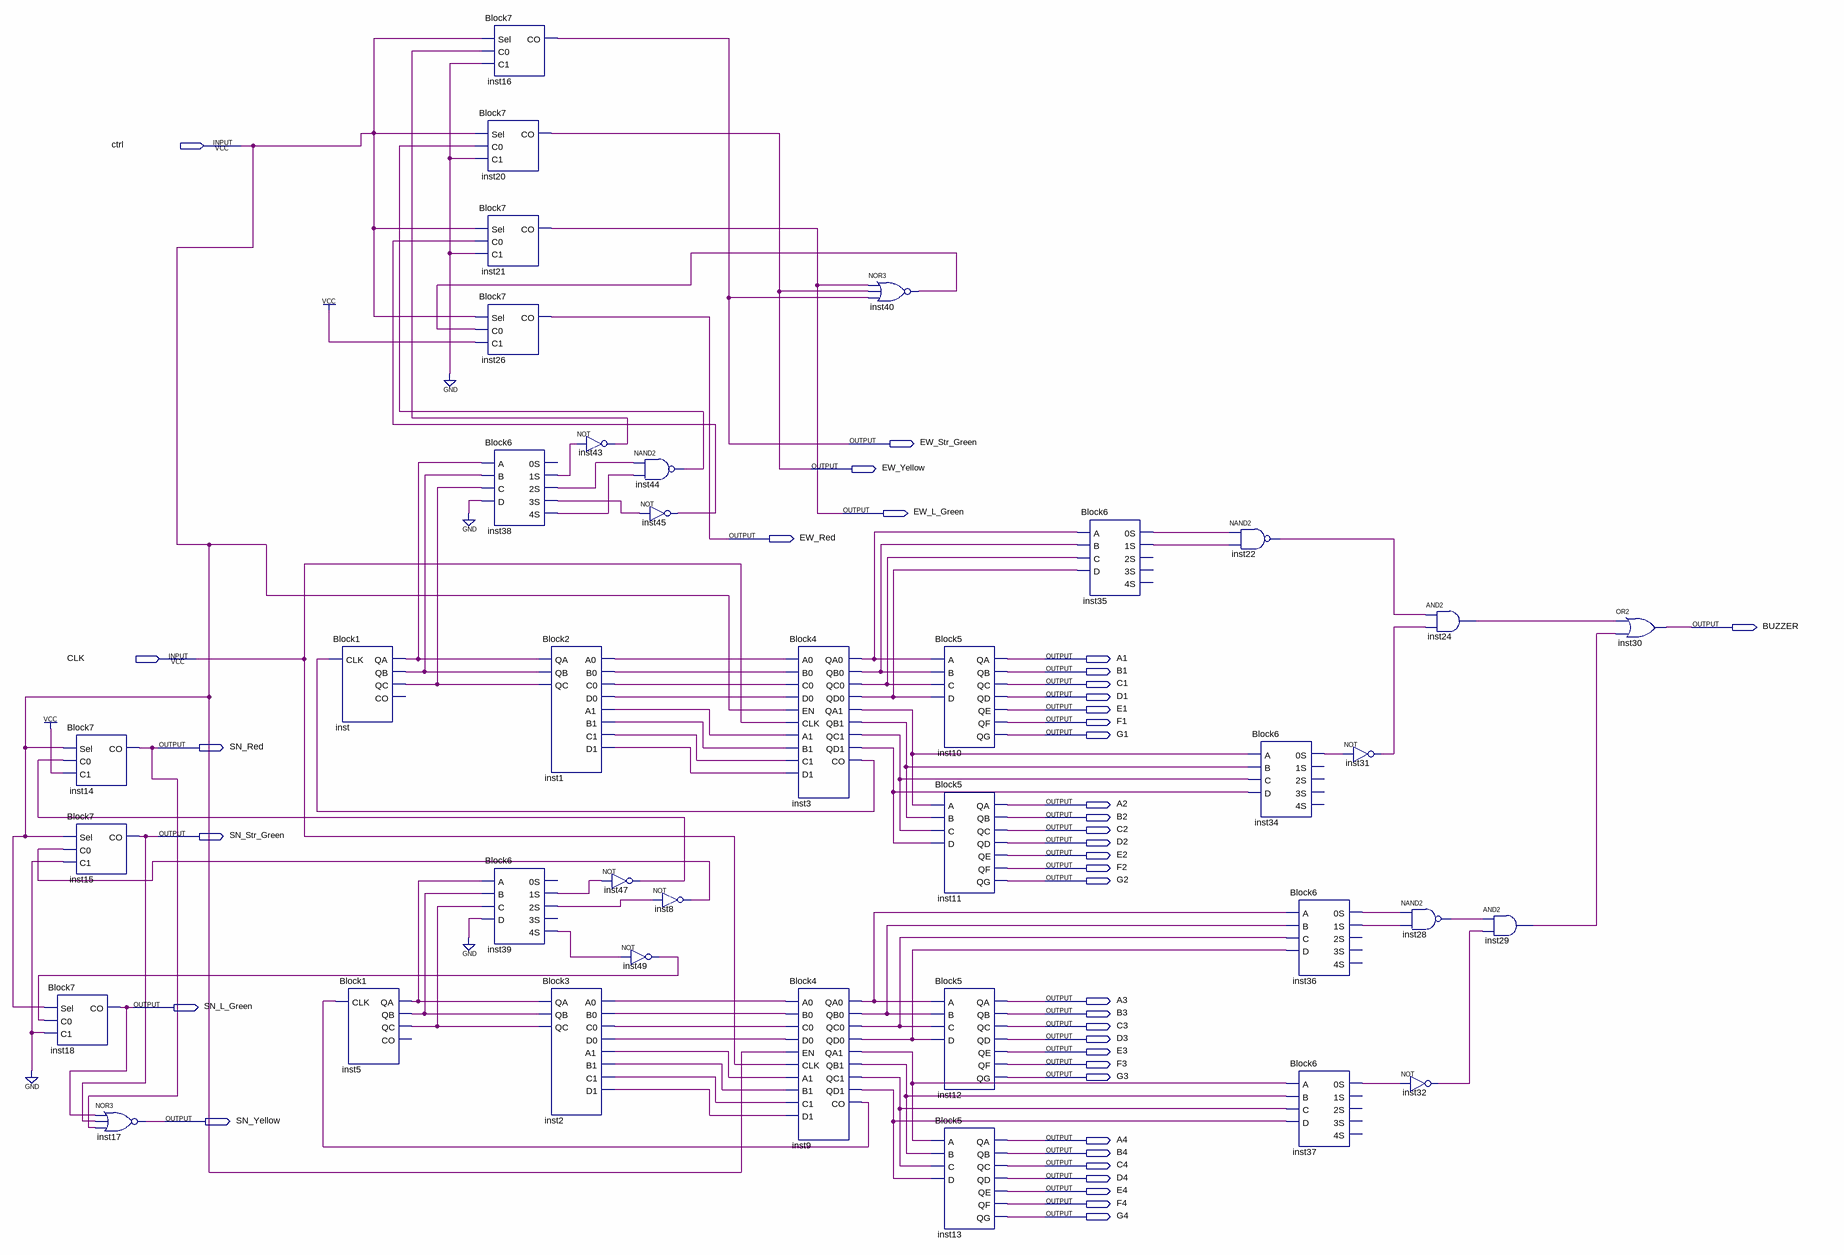
[diagram p0: schematic sheet]
// Quartus schematic TEST.bdf as structural Verilog: 38 symbols, 39 pins
module TEST (
  input  ctrl,
  input  CLK,
  output EW_Str_Green,
  output EW_Yellow,
  output EW_L_Green,
  output EW_Red,
  output BUZZER,
  output A1,
  output B1,
  output C1,
  output D1,
  output E1,
  output F1,
  output G1,
  output SN_Red,
  output A2,
  output B2,
  output C2,
  output SN_Str_Green,
  output D2,
  output E2,
  output F2,
  output G2,
  output A3,
  output SN_L_Green,
  output B3,
  output C3,
  output D3,
  output E3,
  output F3,
  output G3,
  output SN_Yellow,
  output A4,
  output B4,
  output C4,
  output D4,
  output E4,
  output F4,
  output G4
);

  wire inst1_a0, inst1_a1, inst1_b0, inst1_b1, inst1_c0, inst1_c1, inst1_d0, inst1_d1, inst2_a0, inst2_a1,
       inst2_b0, inst2_b1, inst2_c0, inst2_c1, inst2_d0, inst2_d1, inst3_co, inst3_qa0, inst3_qa1, inst3_qb0,
       inst3_qb1, inst3_qc0, inst3_qc1, inst3_qd0, inst3_qd1, inst5_qa, inst5_qb, inst5_qc, inst8_out,
       inst9_co, inst9_qa0, inst9_qa1, inst9_qb0, inst9_qb1, inst9_qc0, inst9_qc1, inst9_qd0, inst9_qd1,
       inst22_out, inst24_out, inst28_out, inst29_out, inst31_out, inst32_out, inst34_0s, inst35_0s,
       inst35_1s, inst36_0s, inst36_1s, inst37_0s, inst38_1s, inst38_2s, inst38_3s, inst38_4s, inst39_1s,
       inst39_2s, inst39_4s, inst40_out, inst43_out, inst44_out, inst45_out, inst47_out, inst49_out, inst_qa,
       inst_qb, inst_qc;

  Block7 inst14 (.Sel(ctrl), .C0(inst47_out), .C1(1'b1), .CO(SN_Red));
  Block7 inst15 (.Sel(ctrl), .C0(inst8_out), .C1(1'b0), .CO(SN_Str_Green));
  Block7 inst18 (.Sel(ctrl), .C0(inst49_out), .C1(1'b0), .CO(SN_L_Green));
  nor inst17 (SN_Yellow, SN_L_Green, SN_Str_Green, SN_Red);
  Block1 inst (.CLK(inst3_co), .QA(inst_qa), .QB(inst_qb), .QC(inst_qc));  // open: CO
  Block1 inst5 (.CLK(inst9_co), .QA(inst5_qa), .QB(inst5_qb), .QC(inst5_qc));  // open: CO
  Block7 inst16 (.Sel(ctrl), .C0(inst43_out), .C1(1'b0), .CO(EW_Str_Green));
  Block7 inst20 (.Sel(ctrl), .C0(inst44_out), .C1(1'b0), .CO(EW_Yellow));
  Block7 inst21 (.Sel(ctrl), .C0(inst45_out), .C1(1'b0), .CO(EW_L_Green));
  Block7 inst26 (.Sel(ctrl), .C0(inst40_out), .C1(1'b1), .CO(EW_Red));
  Block6 inst38 (
    .A(inst_qa), .B(inst_qb), .C(inst_qc), .D(1'b0), .\1S (inst38_1s), .\2S (inst38_2s), .\3S (inst38_3s),
    .\4S (inst38_4s));  // open: 0S
  Block6 inst39 (
    .A(inst5_qa), .B(inst5_qb), .C(inst5_qc), .D(1'b0), .\1S (inst39_1s), .\2S (inst39_2s), .\4S (inst39_4s));  // open: 0S, 3S
  not inst43 (inst43_out, inst38_1s);
  Block2 inst1 (
    .QA(inst_qa), .QB(inst_qb), .QC(inst_qc), .A0(inst1_a0), .B0(inst1_b0), .C0(inst1_c0), .D0(inst1_d0),
    .A1(inst1_a1), .B1(inst1_b1), .C1(inst1_c1), .D1(inst1_d1));
  Block3 inst2 (
    .QA(inst5_qa), .QB(inst5_qb), .QC(inst5_qc), .A0(inst2_a0), .B0(inst2_b0), .C0(inst2_c0), .D0(inst2_d0),
    .A1(inst2_a1), .B1(inst2_b1), .C1(inst2_c1), .D1(inst2_d1));
  nand inst44 (inst44_out, inst38_2s, inst38_4s);
  not inst47 (inst47_out, inst39_1s);
  not inst49 (inst49_out, inst39_4s);
  not inst45 (inst45_out, inst38_3s);
  not inst8 (inst8_out, inst39_2s);
  Block4 inst3 (
    .A0(inst1_a0), .B0(inst1_b0), .C0(inst1_c0), .D0(inst1_d0), .EN(ctrl), .CLK(CLK), .A1(inst1_a1),
    .B1(inst1_b1), .C1(inst1_c1), .D1(inst1_d1), .QA0(inst3_qa0), .QB0(inst3_qb0), .QC0(inst3_qc0),
    .QD0(inst3_qd0), .QA1(inst3_qa1), .QB1(inst3_qb1), .QC1(inst3_qc1), .QD1(inst3_qd1), .CO(inst3_co));
  Block4 inst9 (
    .A0(inst2_a0), .B0(inst2_b0), .C0(inst2_c0), .D0(inst2_d0), .EN(ctrl), .CLK(CLK), .A1(inst2_a1),
    .B1(inst2_b1), .C1(inst2_c1), .D1(inst2_d1), .QA0(inst9_qa0), .QB0(inst9_qb0), .QC0(inst9_qc0),
    .QD0(inst9_qd0), .QA1(inst9_qa1), .QB1(inst9_qb1), .QC1(inst9_qc1), .QD1(inst9_qd1), .CO(inst9_co));
  nor inst40 (inst40_out, EW_L_Green, EW_Yellow, EW_Str_Green);
  Block5 inst10 (
    .A(inst3_qa0), .B(inst3_qb0), .C(inst3_qc0), .D(inst3_qd0), .QA(A1), .QB(B1), .QC(C1), .QD(D1), .QE(E1),
    .QF(F1), .QG(G1));
  Block5 inst11 (
    .A(inst3_qa1), .B(inst3_qb1), .C(inst3_qc1), .D(inst3_qd1), .QA(A2), .QB(B2), .QC(C2), .QD(D2), .QE(E2),
    .QF(F2), .QG(G2));
  Block5 inst12 (
    .A(inst9_qa0), .B(inst9_qb0), .C(inst9_qc0), .D(inst9_qd0), .QA(A3), .QB(B3), .QC(C3), .QD(D3), .QE(E3),
    .QF(F3), .QG(G3));
  Block5 inst13 (
    .A(inst9_qa1), .B(inst9_qb1), .C(inst9_qc1), .D(inst9_qd1), .QA(A4), .QB(B4), .QC(C4), .QD(D4), .QE(E4),
    .QF(F4), .QG(G4));
  Block6 inst35 (
    .A(inst3_qa0), .B(inst3_qb0), .C(inst3_qc0), .D(inst3_qd0), .\0S (inst35_0s), .\1S (inst35_1s));  // open: 2S, 3S, 4S
  nand inst22 (inst22_out, inst35_0s, inst35_1s);
  Block6 inst34 (.A(inst3_qa1), .B(inst3_qb1), .C(inst3_qc1), .D(inst3_qd1), .\0S (inst34_0s));  // open: 1S, 2S, 3S, 4S
  Block6 inst36 (
    .A(inst9_qa0), .B(inst9_qb0), .C(inst9_qc0), .D(inst9_qd0), .\0S (inst36_0s), .\1S (inst36_1s));  // open: 2S, 3S, 4S
  Block6 inst37 (.A(inst9_qa1), .B(inst9_qb1), .C(inst9_qc1), .D(inst9_qd1), .\0S (inst37_0s));  // open: 1S, 2S, 3S, 4S
  not inst31 (inst31_out, inst34_0s);
  and inst24 (inst24_out, inst22_out, inst31_out);
  nand inst28 (inst28_out, inst36_0s, inst36_1s);
  not inst32 (inst32_out, inst37_0s);
  and inst29 (inst29_out, inst28_out, inst32_out);
  or inst30 (BUZZER, inst24_out, inst29_out);
endmodule
